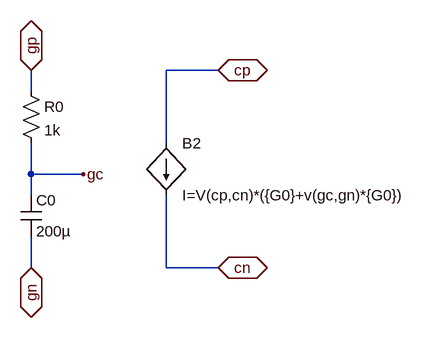
[diagram p0: schematic graphite_sensor.asc]
graphite_sensor.asc, the LTspice schematic file:
Version 4
SHEET 1 996 680
WIRE 640 16 560 16
WIRE 352 48 352 16
WIRE 560 128 560 16
WIRE 352 176 352 128
WIRE 432 176 352 176
WIRE 352 208 352 176
WIRE 352 320 352 272
WIRE 560 320 560 208
WIRE 640 320 560 320
FLAG 352 16 gp
IOPIN 352 16 BiDir
FLAG 352 320 gn
IOPIN 352 320 BiDir
FLAG 640 16 cp
IOPIN 640 16 BiDir
FLAG 640 320 cn
IOPIN 640 320 BiDir
FLAG 432 176 gc
SYMBOL res 336 32 R0
SYMATTR InstName R0
SYMATTR Value 1k
SYMBOL cap 336 208 R0
SYMATTR InstName C0
SYMATTR Value 200µ
SYMBOL bi 560 128 R0
SYMATTR InstName B2
SYMATTR Value I=V(cp,cn)*({G0}+v(gc,gn)*{G0})

The netlist it stands for:
* graphite_sensor.asc
R0 gp gc 1k
C0 gc gn 200µ
B2 cp cn I=V(cp,cn)*({G0}+v(gc,gn)*{G0})
.backanno
.end